# Altium schematic sheet RT v1.3_Connect.SchDoc
size A3
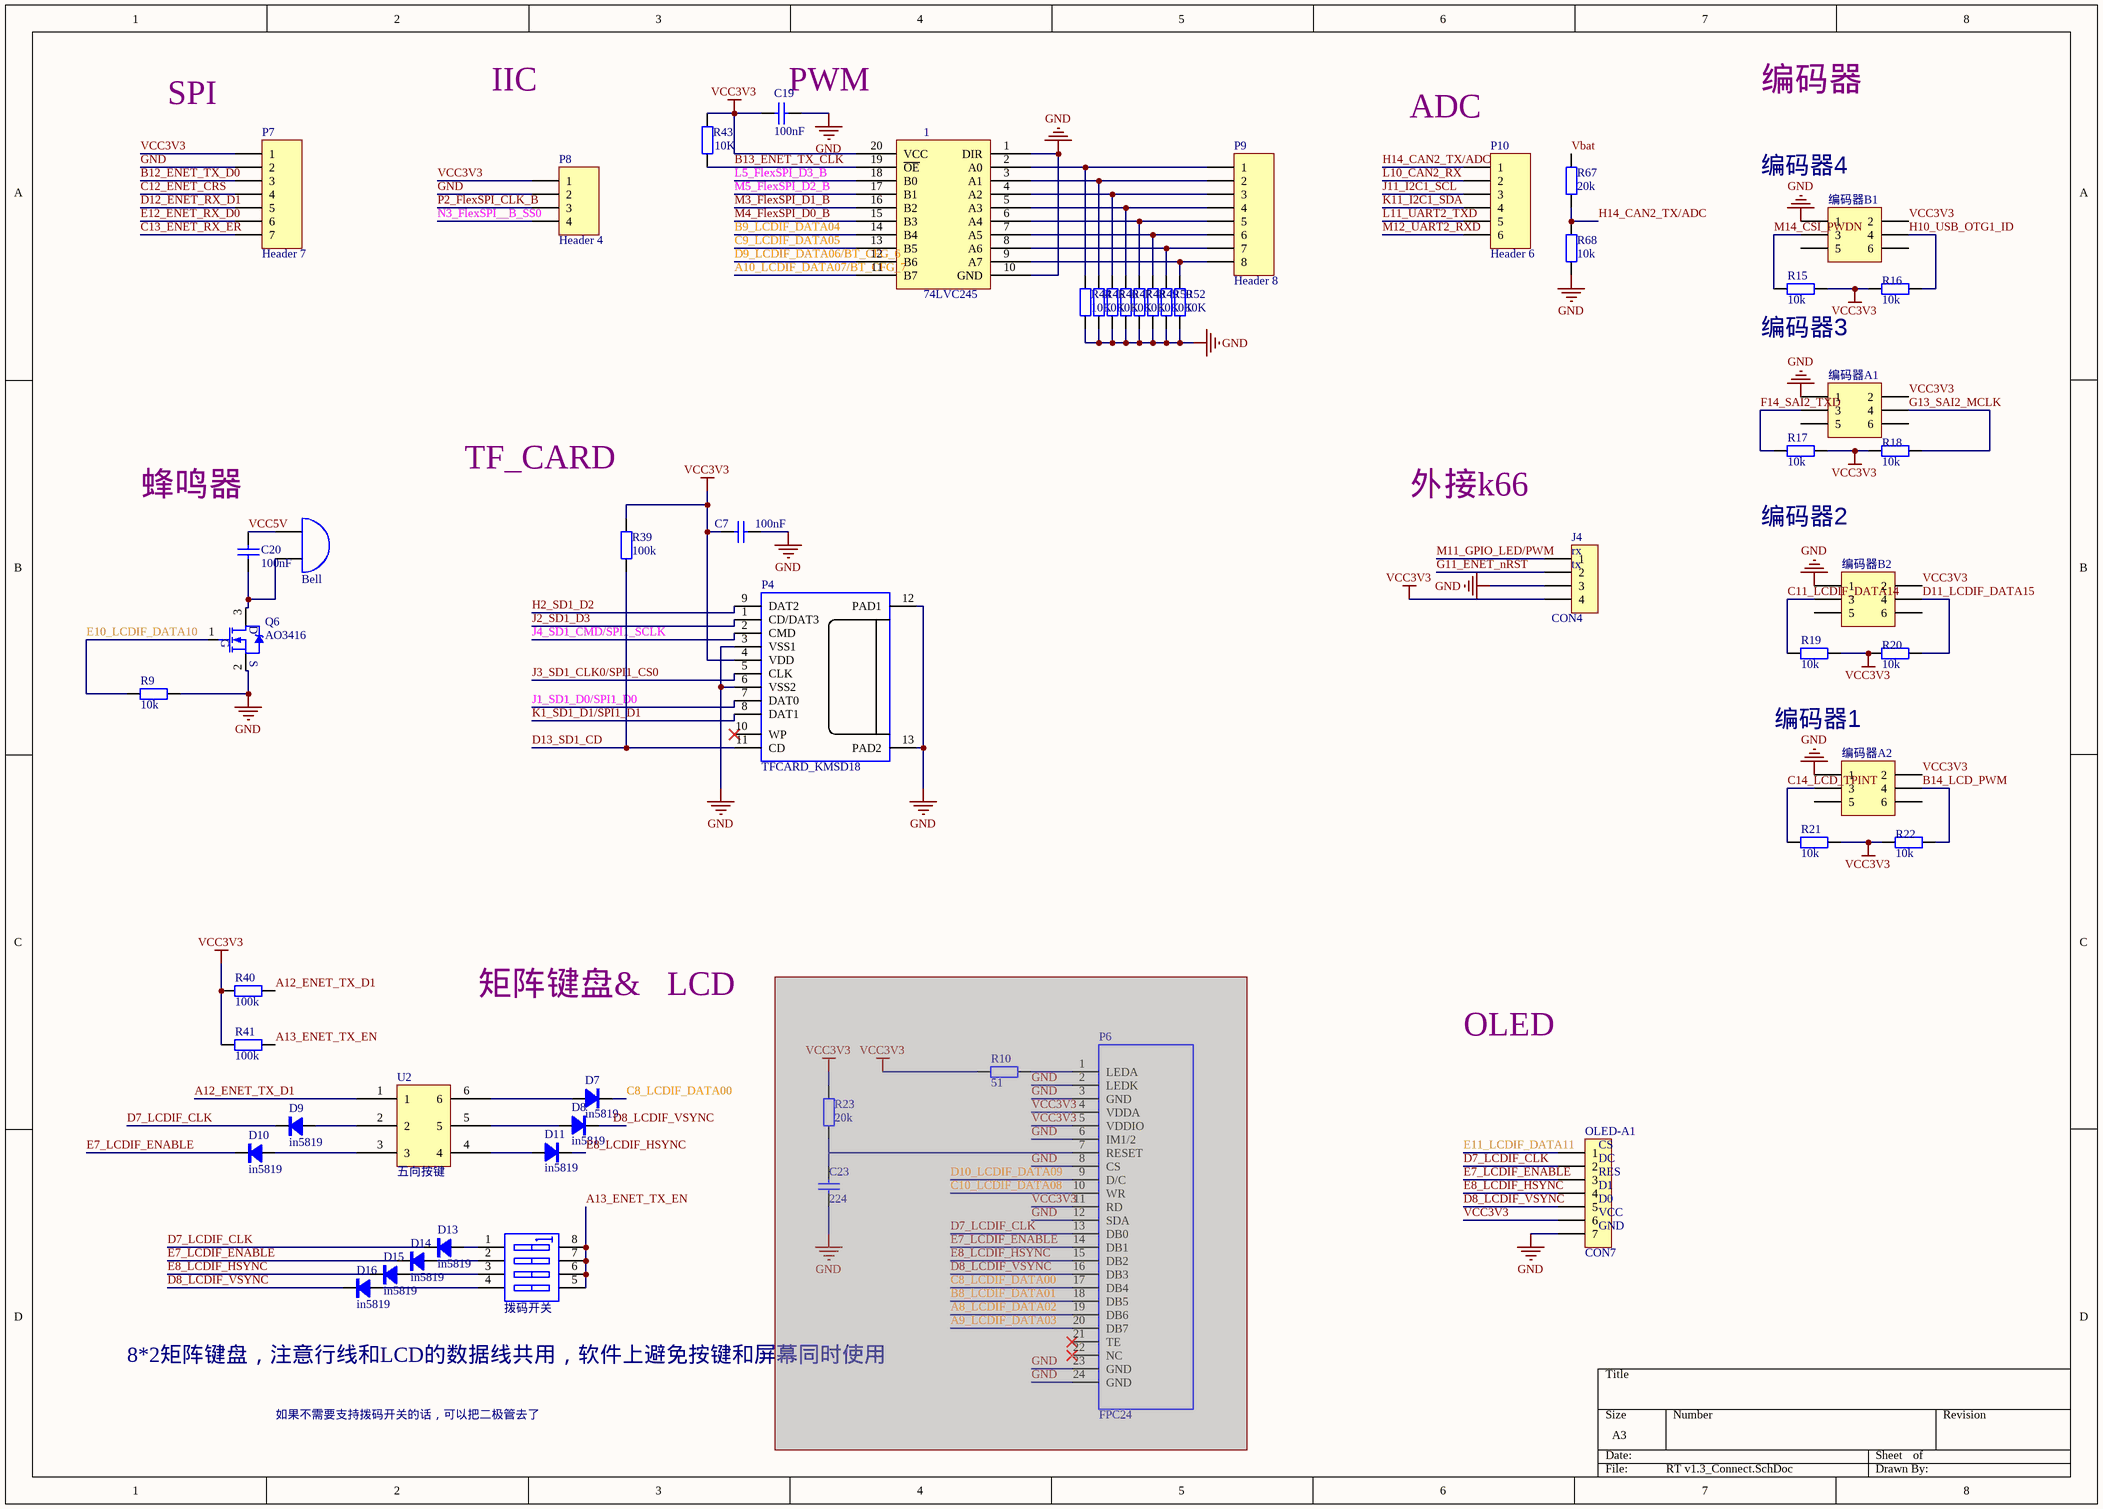
[diagram p0: RT v1.3_Connect.SchDoc]

## Parts
1  74LVC245  [TSSOP_20]
BOMA1  拨码开关  [switch]
C7  100nF  [0603C+]
C19  100nF  [CAPC_0603_1]
C20  100nF  [0603C+]
C23  value 224  [0603C+]  (hidden comment: 0.1uF)  (masked out: inside a compile mask, not in the netlist)
D7  in5819  [0805_Dio]
D8  in5819  [0805_Dio]
D9  in5819  [0805_Dio]
D10  in5819  [0805_Dio]
D11  in5819  [0805_Dio]
D13  in5819  [0805_Dio]
D14  in5819  [0805_Dio]
D15  in5819  [0805_Dio]
D16  in5819  [0805_Dio]
J4  CON4  [Fe-HDR1X4/2.54-S]
LS1  Bell  [BEEP 5x9x5.5]
OLED-A1  CON7  [HDR1X7]
P4  TFCARD_KMSD18  [TF-CARD]
P6  FPC24  [FPC24]  (masked out: inside a compile mask, not in the netlist)
P7  Header 7  [HDR1X7]
P8  Header 4  [HDR1X4]
P9  Header 8  [HDR1X8]
P10  Header 6  [HDR1X6]
Q6  AO3416  [SOT95P245X110-3N]
R9  value 10k  [0603R]  (hidden comment: 470欧)
R10  value 51  [0603R]  (hidden comment: 470欧)  (masked out: inside a compile mask, not in the netlist)
R15  10k  [0603_Res]
R16  10k  [0603_Res]
R17  10k  [0603_Res]
R18  10k  [0603_Res]
R19  10k  [0603_Res]
R20  10k  [0603_Res]
R21  10k  [0603_Res]
R22  10k  [0603_Res]
R23  value 20k  [0603R]  (hidden comment: 470欧)  (masked out: inside a compile mask, not in the netlist)
R39  value 100k  [0603R]  (hidden comment: 470欧)
R40  value 100k  [0603R]  (hidden comment: 470欧)
R41  value 100k  [0603R]  (hidden comment: 470欧)
R43  value 10K  [0603R]  (hidden comment: Res2)
R44  value 10K  [0603R]  (hidden comment: Res2)
R45  value 10K  [0603R]  (hidden comment: Res2)
R46  value 10K  [0603R]  (hidden comment: Res2)
R47  value 10K  [0603R]  (hidden comment: Res2)
R48  value 10K  [0603R]  (hidden comment: Res2)
R49  value 10K  [0603R]  (hidden comment: Res2)
R50  value 10K  [0603R]  (hidden comment: Res2)
R52  value 10K  [0603R]  (hidden comment: Res2)
R67  20k  [0603_Res]
R68  10k  [0603_Res]
U2  五向按键  [wuxiang]
编码器A1  (no value)  [1.27_4Pin]
编码器A2  (no value)  [1.27_4Pin]
编码器B1  (no value)  [1.27_4Pin]
编码器B2  (no value)  [1.27_4Pin]

## Nets
GND: 1.1(DIR) 1.10(GND) C7.1 C19.2 J4.3 OLED-A1.7 P4.3(VSS1) P4.6(VSS2) P4.12(PAD1) P4.13(PAD2) P7.2 P8.2 Q6.2(S) R9.1 R44.1 R45.1 R46.1 R47.1 R48.1 R49.1 R50.1 R52.1 R68.2 编码器A1.1 编码器A2.1 编码器B1.1 编码器B2.1
VCC3V3: 1.20(VCC) C7.2 C19.1 J4.4 OLED-A1.6 P4.4(VDD) P7.1 P8.1 R15.1(vcc) R16.2 R17.1(vcc) R18.2 R19.1(vcc) R20.2 R21.1(vcc) R22.2 R39.2 R40.2 R41.2 R43.2 编码器A1.2 编码器A2.2 编码器B1.2 编码器B2.2
A10_LCDIF_DATA07/BT_CFG_7: 1.11(B7)
A12_ENET_TX_D1: R40.1 U2.1
A13_ENET_TX_EN: BOMA1.5(B4) BOMA1.6(B3) BOMA1.7(B2) BOMA1.8(B1) R41.1
B9_LCDIF_DATA04: 1.14(B4)
B12_ENET_TX_D0: P7.3
B13_ENET_TX_CLK: 1.19(~{OE}) R43.1
B14_LCD_PWM: R22.1(vcc) 编码器A2.4
C8_LCDIF_DATA00: D7.2(K)
C9_LCDIF_DATA05: 1.13(B5)
C11_LCDIF_DATA14: R19.2 编码器B2.3
C12_ENET_CRS: P7.4
C13_ENET_RX_ER: P7.7
C14_LCD_TPINT: R21.2 编码器A2.3
D7_LCDIF_CLK: D9.2(K) D13.2(K) OLED-A1.2
D8_LCDIF_VSYNC: D8.2(K) D16.2(K) OLED-A1.5
D9_LCDIF_DATA06/BT_CFG_6: 1.12(B6)
D11_LCDIF_DATA15: R20.1(vcc) 编码器B2.4
D12_ENET_RX_D1: P7.5
D13_SD1_CD: P4.11(CD) R39.1
E7_LCDIF_ENABLE: D10.2(K) D14.2(K) OLED-A1.3
E8_LCDIF_HSYNC: D11.2(K) D15.2(K) OLED-A1.4
E10_LCDIF_DATA10: Q6.1(G) R9.2
E11_LCDIF_DATA11: OLED-A1.1
E12_ENET_RX_D0: P7.6
F14_SAI2_TXD: R17.2 编码器A1.3
G11_ENET_nRST: J4.2
G13_SAI2_MCLK: R18.1(vcc) 编码器A1.4
H2_SD1_D2: P4.9(DAT2)
H10_USB_OTG1_ID: R16.1(vcc) 编码器B1.4
H14_CAN2_TX/ADC: P10.1 R67.2 R68.1(vcc)
J1_SD1_D0/SPI1_D0: P4.7(DAT0)
J2_SD1_D3: P4.1(CD/DAT3)
J3_SD1_CLK0/SPI1_CS0: P4.5(CLK)
J4_SD1_CMD/SPI1_SCLK: P4.2(CMD)
J11_I2C1_SCL: P10.3
K1_SD1_D1/SPI1_D1: P4.8(DAT1)
K11_I2C1_SDA: P10.4
L5_FlexSPI_D3_B: 1.18(B0)
L10_CAN2_RX: P10.2
L11_UART2_TXD: P10.5
M3_FlexSPI_D1_B: 1.16(B2)
M4_FlexSPI_D0_B: 1.15(B3)
M5_FlexSPI_D2_B: 1.17(B1)
M11_GPIO_LED/PWM: J4.1
M12_UART2_RXD: P10.6
M14_CSI_PWDN: R15.2 编码器B1.3
N3_FlexSPI__B_SS0: P8.4
P2_FlexSPI_CLK_B: P8.3
Vbat: R67.1(vcc)
VCC5V: C20.2 LS1.1(A)
Net1_2: 1.2(A0) P9.1 R44.2
Net1_3: 1.3(A1) P9.2 R45.2
Net1_4: 1.4(A2) P9.3 R46.2
Net1_5: 1.5(A3) P9.4 R47.2
Net1_6: 1.6(A4) P9.5 R48.2
Net1_7: 1.7(A5) P9.6 R49.2
Net1_8: 1.8(A6) P9.7 R50.2
Net1_9: 1.9(A7) P9.8 R52.2
NetBOMA1_1: BOMA1.1(A1) D13.1(A)
NetBOMA1_2: BOMA1.2(A2) D14.1(A)
NetBOMA1_3: BOMA1.3(A3) D15.1(A)
NetBOMA1_4: BOMA1.4(A4) D16.1(A)
NetC20_1: C20.1 LS1.2(B) Q6.3(D)
NetD7_1: D7.1(A) U2.6
NetD8_1: D8.1(A) U2.5
NetD9_1: D9.1(A) U2.2
NetD10_1: D10.1(A) U2.3
NetD11_1: D11.1(A) U2.4

Not connected (* = marked no-connect by the designer): P4 10(WP)*; 编码器A1 5 6; 编码器A2 5 6; 编码器B1 5 6; 编码器B2 5 6

## Notes on the sheet
- SPI
- IIC
- (near C19) PWM
- 编码器
- (near P10) ADC
- (near 编码器B1) 编码器4
- (near R15) 编码器3
- 蜂鸣器
- TF_CARD
- 外接k66
- (near J4) rx
- (near J4) tx
- 编码器2
- 编码器1
- 矩阵键盘&
- LCD
- OLED
- (near OLED-A1) D1
- (near OLED-A1) RES
- (near OLED-A1) DC
- (near OLED-A1) CS
- (near OLED-A1) GND
- (near OLED-A1) VCC
- (near OLED-A1) D0
- 8*2矩阵键盘，注意行线和LCD的数据线共用，软件上避免按键和屏幕同时使用
- 如果不需要支持拨码开关的话，可以把二极管去了

## Library data of the parts
1 = 74lvc245: 8位5伏转3.3伏电平转换芯片
BOMA1 = SW DIP-4: DIP Switch, 4 Position, SPST; Published: 24-Mar-1999; LatestRevisionDate: 29-May-2009; LatestRevisionNote: IPC-7351 Footprint Added.; PackageVersion: Dec-2002; PackageReference: SO8; Publisher: Altium Limited; PackageDescription: 8-Pin Small Outline Integrated Circuit 1.27 mm Pitch; Code_JEDEC: MS-012-AA; Code_IPC: SOIC127P600-8
C7 C20 C23 = Cap: Capacitor; Published: 8-Jun-2000; LatestRevisionDate: 17-Jul-2002; LatestRevisionNote: Re-released for DXP Platform.; PackageReference: RAD-0.3; Publisher: Altium Limited; PackageDescription: Radial Cap, Thru-Hole; 2 Leads; 0.3 in Pin Spacing
  C7 C20: Value: 100nF
C19 = CAP: Capacitor
D7-D11 D13-D16 = DIO
J4 = CON4: Connector
LS1 = Bell: Electrical Bell; Published: 24-Mar-1999; LatestRevisionDate: 17-Jul-2002; LatestRevisionNote: Re-released for DXP Platform.; PackageReference: PIN2; Publisher: Altium Limited
OLED-A1 = CON7: Connector
P4 = SDCARD_KMSD18
P6 = CON24
P7 = Header 7: Header, 7-Pin; LatestRevisionDate: 17-Jul-2002; LatestRevisionNote: Re-released for DXP Platform.; Publisher: Altium Limited
P8 = Header 4: Header, 4-Pin; LatestRevisionDate: 17-Jul-2002; LatestRevisionNote: Re-released for DXP Platform.; Publisher: Altium Limited
P9 = Header 8: Header, 8-Pin; LatestRevisionDate: 17-Jul-2002; LatestRevisionNote: Re-released for DXP Platform.; Publisher: Altium Limited
P10 = Header 6: Header, 6-Pin; LatestRevisionDate: 17-Jul-2002; LatestRevisionNote: Re-released for DXP Platform.; Publisher: Altium Limited
Q6 = NMOS: N-Channel Power MOSFET; Note: Pin 2 is electrically connected to pin 4.; Published: 8-Jun-2000; LatestRevisionDate: 17-Jul-2002; LatestRevisionNote: Re-released for DXP Platform.; DatasheetVersion: PD-9.814; PackageVersion: Feb-1997; PackageReference: TO-220AB; Publisher: Altium Limited; PackageDescription: TO, Thru-Hole, Vertical, Heatsink Mounted; 3 In-Line Leads; Pitch 2.54 mm; ComponentLink1Description: Manufacturer Link; ComponentLink1URL: http://www.irf.com/; VALUE: AO3416
R9 R10 R23 R39-R41 = Res2_1: Resistor; Published: 8-Jun-2000; LatestRevisionDate: 17-Jul-2002; LatestRevisionNote: Re-released for DXP Platform.; PackageReference: AXIAL-0.4; Publisher: Altium Limited
R15-R22 R67 R68 = RES_MD
R43-R50 R52 = Res2: Resistor; Published: 8-Jun-2000; LatestRevisionDate: 17-Jul-2002; LatestRevisionNote: Re-released for DXP Platform.; PackageReference: AXIAL-0.4; Publisher: Altium Limited; PackageDescription: Axial Device, Thru-Hole; 2 Leads; 0.4 in Pin Spacing
编码器A1 编码器A2 编码器B1 编码器B2 = Header 3X2: Header, 3-Pin, Dual row; LatestRevisionDate: 17-Jul-2002; LatestRevisionNote: Re-released for DXP Platform.; Publisher: Altium Limited